# Altium schematic sheet SD.SchDoc
size A4
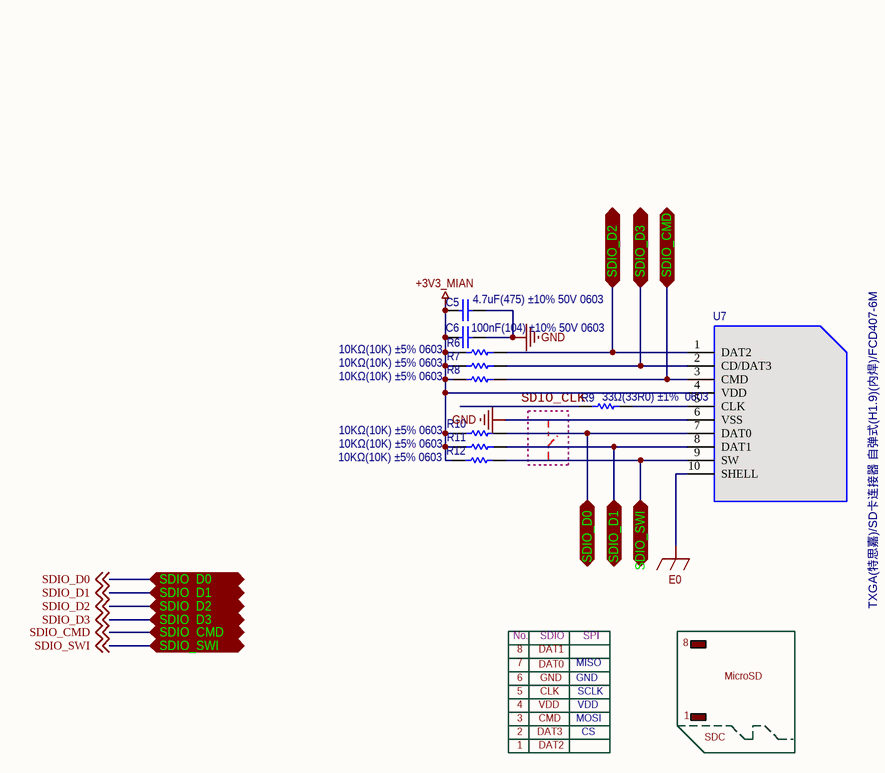
[diagram p0: SD.SchDoc]

## Parts
C5  4.7uF(475) ±10% 50V 0603  [C0603]
C6  100nF(104) ±10% 50V 0603  [C0603]
R6  10KΩ(10K) ±5% 0603  [R0603]
R7  10KΩ(10K) ±5% 0603  [R0603]
R8  10KΩ(10K) ±5% 0603  [R0603]
R9  33Ω(33R0) ±1%  0603  [R0603]
R10  10KΩ(10K) ±5% 0603  [R0603]
R11  10KΩ(10K) ±5% 0603  [R0603]
R12  10KΩ(10K) ±5% 0603  [R0603]
U7  TXGA(特思嘉)/SD卡连接器 自弹式(H1.9)(内焊)/FCD407-6M  [Micro SD]

## Ports
SDIO_CMD, SDIO_D0, SDIO_D1, SDIO_D2, SDIO_D3, SDIO_SWI

## Nets
+3V3_MIAN: C5.1 C6.2 R6.2 R7.2 R8.2 R10.2 R11.2 R12.2 U7.4(VDD)
E0: U7.10(SHELL)
GND: C5.2 C6.1 U7.6(VSS)
SDIO_CLK: R9.2
SDIO_CMD: R8.1 U7.3(CMD) ; off-sheet SDIO_CMD, port SDIO_CMD
SDIO_D0: R10.1 U7.7(DAT0) ; off-sheet SDIO_D0, port SDIO_D0
SDIO_D1: R11.1 U7.8(DAT1) ; off-sheet SDIO_D1, port SDIO_D1
SDIO_D2: R6.1 U7.1(DAT2) ; off-sheet SDIO_D2, port SDIO_D2
SDIO_D3: R7.1 U7.2(CD/DAT3) ; off-sheet SDIO_D3, port SDIO_D3
SDIO_SWI: R12.1 U7.9(SW) ; off-sheet SDIO_SWI, port SDIO_SWI
NetR9_1: R9.1 U7.5(CLK)

## Notes on the sheet
- No.
- 8
- 7
- DAT1
- DAT0
- SDIO
- MISO
- SPI
- 6
- 5
- 4
- 3
- 2
- DAT3
- VDD
- CMD
- GND
- CLK
- MOSI
- SCLK
- CS
- 1
- MicroSD
- DAT2
- SDC

## Library data of the parts
C5 C6 = Cap: Capacitor; Published: 8-Jun-2000; LatestRevisionDate: 17-Jul-2002; LatestRevisionNote: Re-released for DXP Platform.; PackageReference: RAD-0.3; Publisher: Altium Limited; PackageDescription: Radial Cap, Thru-Hole; 2 Leads; 0.3 in Pin Spacing
R6-R12 = Res1: Resistor; Published: 8-Jun-2000; LatestRevisionDate: 17-Jul-2002; LatestRevisionNote: Re-released for DXP Platform.; PackageReference: AXIAL-0.3; Publisher: Altium Limited; PackageDescription: Axial Device, Thru-Hole; 2 Leads; 0.3 in Pin Spacing
U7 = SD CARD/FCD407-6M